# Altium schematic sheet Sheet2.SchDoc
size A4
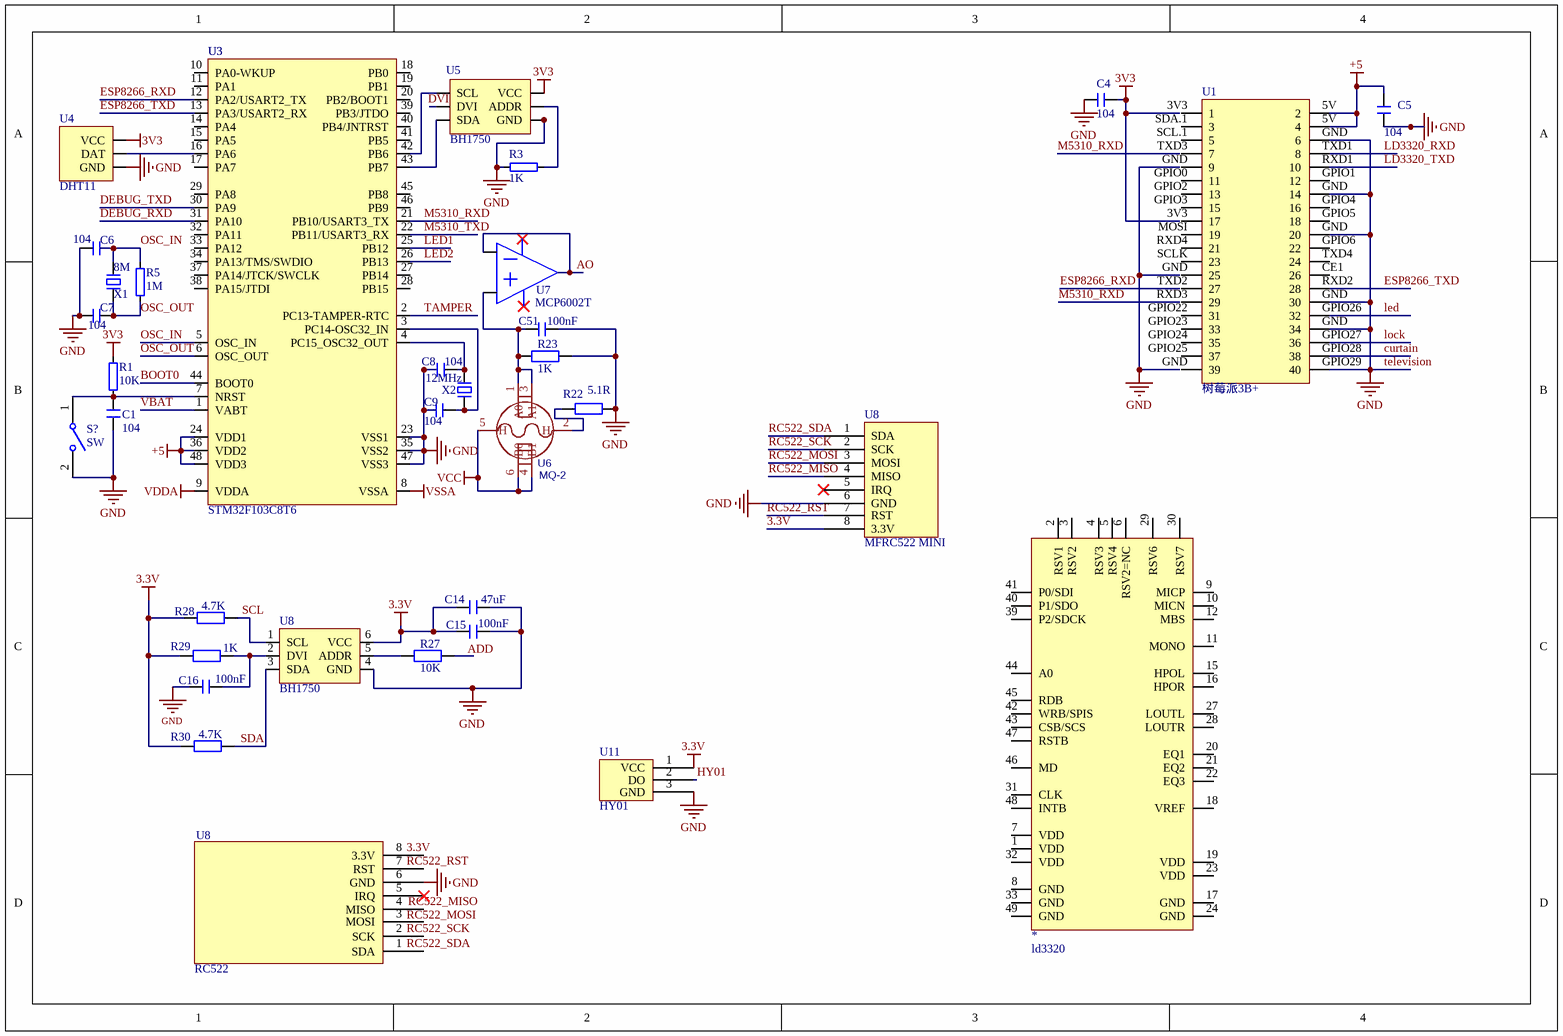
[diagram p0: Sheet2.SchDoc]

## Parts
(Parts that share a designator on the sheet are numbered #1, #2 ... from top to bottom, then left to right.)
*  ld3320
C1  104  [0603C]
C4  104  [0603C]
C5  104  [0603C]
C6  104  [0603C]
C7  104  [0603C]
C8  104  [0603C]
C9  104  [0603C]
C14  47uF  [0603C]
C15  100nF  [C 0805_L]
C16  100nF  [C 0805_L]
C51  100nF  [C 0805_L]
R1  10K  [R 0603_M]
R3  1K  [R 0603_M]
R5  1M  [R 0603_M]
R22  5.1R  [R 0805_L]
R23  1K  [R 0805_L]
R27  10K  [R 0805_L]
R28  4.7K  [R 0805_L]
R29  1K  [R 0805_L]
R30  4.7K  [R 0805_L]
S?  SW  [TSW SMD-3*6*5]
U1  树莓派3B+
U3  STM32F103C8T6  [LQFP-48_M]
U4  DHT11
U5  BH1750
U6  MQ-2  [SENSOR-TH_MQ-2]
U7  MCP6002T  [R 0603_M]
U8#1  MFRC522 MINI
U8#2  BH1750
U8#3  RC522  (part B of 2)
U11  HY01
X1  8M  [OSC UM-5 - duplicate]
X2  12MHz  [OSC UM-5 - duplicate]

## Nets
3.3V: C14.1 C15.2 R28.2 R29.2 R30.2 U8#1.8(3.3V) U8#2.6(VCC) U11.1(VCC)
3V3: C4.1 R1.2 U4.VCC U5.SDA.28(VCC)
+5: C5.1 U1.5V(2) U3.24(VDD1) U3.36(VDD2) U3.48(VDD3)
television: C1.1 C4.2 C5.2 C6.1 C7.1 C8.1 C9.1 C14.2 C15.1 C16.2 C51.1 R3.2 R22.1 R23.1 S?.2 U1.GND(6) U1.GPIO29(40) U3.23(VSS1) U3.35(VSS2) U3.47(VSS3) U4.SDA.23(GND) U5.SDA.30(GND) U8#1.6(GND) U8#2.4(GND) U8#3.6(GND) U11.3(GND)  [also labelled GND]
VCC: U6.4(B1) U6.5(H) U6.6(B0)
VDDA: U3.9(VDDA)
VSSA: U3.8(VSSA)
BOOT0: U3.44(BOOT0)
curtain: U1.GPIO28(38)
DEBUG_RXD: U3.31(PA10)
DEBUG_TXD: U3.30(PA9)
ESP8266_RXD: U3.12(PA2/USART2_TX)
ESP8266_TXD: U1.RXD2(28) U3.13(PA3/USART2_RX)
HY01: U11.2(DO)
LD3320_RXD: U1.TXD1(8)
LD3320_TXD: U1.RXD1(10)
led: U1.GPIO26(32)
LED1: U3.25(PB12)
LED2: U3.26(PB13)
lock: U1.GPIO27(36)
M5310_RXD: U3.21(PB10/USART3_TX)
M5310_TXD: U3.22(PB11/USART3_RX)
OSC_IN: C6.2 R5.2 U3.5(OSC_IN) X1.2
OSC_OUT: C7.2 R5.1 U3.6(OSC_OUT) X1.1
RC522_MISO: U8#1.4(MISO)
RC522_MOSI: U8#1.3(MOSI)
RC522_RST: U8#1.7(RST)
RC522_SCK: U8#1.2(SCK)
RC522_SDA: U8#1.1(SDA)
SCL: R28.1 U8#2.1(SCL)
SDA: R30.1 U8#2.3(SDA)
TAMPER: U3.2(PC13-TAMPER-RTC)
VBAT: U3.1(VABT)
NetC1_2: C1.2 R1.1 S?.1 U3.7(NRST)
NetC8_2: C8.2 U3.4(PC15_OSC32_OUT) X2.1
NetC9_2: C9.2 U3.3(PC14-OSC32_IN) X2.2
NetC16_1: C16.1 R29.1 U8#2.2(DVI)
NetC51_2: C51.2 R23.2 U6.1(A0) U6.3(A1)
NetR3_1: R3.1 U5.SDA.29(ADDR)
NetR22_2: R22.2 U6.2(H)
NetR27_2: R27.2 U8#2.5(ADDR)
NetU3_16: U3.16(PA6) U4.SDA.24(DAT)
NetU3_42: U3.42(PB6) U5.SCL
NetU3_43: U3.43(PB7) U5.SDA.27(SDA)

Not connected (* = marked no-connect by the designer): * 1(VDD) 2(RSV1) 3(RSV2) 4(RSV3) 5(RSV4) 6(RSV2=NC) 7(VDD) 8(GND) 9(MICP) 10(MICN) 11(MONO) 12(MBS) 15(HPOL) 16(HPOR) 17(GND) 18(VREF) 19(VDD) 20(EQ1) 21(EQ2) 22(EQ3) 23(VDD) 24(GND) 27(LOUTL) 28(LOUTR) 29(RSV6) 30(RSV7) 31(CLK) 32(VDD) 33(GND) 39(P2/SDCK) 40(P1/SDO) 41(P0/SDI) 42(WRB/SPIS) 43(CSB/SCS) 44(A0) 45(RDB) 46(MD) 47(RSTB) 48(INTB) 49(GND); R27 1; U1 3V3(1) CE1(26) GPIO0(11) GPIO1(12) GPIO2(13) GPIO3(15) GPIO4(16) GPIO5(18) GPIO6(22) GPIO22(31) GPIO23(33) GPIO24(35) GPIO25(37) MOSI(19) RXD3(29) RXD4(21) SCL.1(5) SCLK(23) SDA.1(3) TXD2(27) TXD3(7) TXD4(24); U3 10(PA0-WKUP) 11(PA1) 14(PA4) 15(PA5) 17(PA7) 18(PB0) 19(PB1) 20(PB2/BOOT1) 27(PB14) 28(PB15) 29(PA8) 32(PA11) 33(PA12) 34(PA13/TMS/SWDIO) 37(PA14/JTCK/SWCLK) 38(PA15/JTDI) 39(PB3/JTDO) 40(PB4/JNTRST) 41(PB5) 45(PB8) 46(PB9); U5 SDA.26(DVI); U8#1 5(IRQ)*; U8#3 1(SDA) 2(SCK) 3(MOSI) 4(MISO) 5(IRQ)* 7(RST) 8(3.3V)

## Notes on the sheet
- (near U3) U3
- (near U1) 树莓派3B+
- U8
- Labels drawn without touching a wire or pin: 3.3V, ADD, DVI, RC522_MISO, RC522_MOSI, RC522_RST, RC522_SCK, RC522_SDA

## Library data of the parts
C1 C4-C9 C14-C16 C51 = C: 无极性贴片电容; 版权归属: 源创客; BOM名称: 无极性贴片电容; 学习资源: www.ooocke.com
R1 R3 R5 U7 = 普通电阻
R22 R23 R27-R30 = R: 贴片电阻; 版权归属: 源创客; BOM名称: 贴片电阻; 学习资源: www.ooocke.com
S? = KCD1-101: 1路单刀船型开关; 版权归属: 源创客; BOM名称: 1路单刀船型开关; 学习资源: www.ooocke.com
U1 = pi
U3 = STM32F103C8T6: IC
U6 = MQ-2: BOM_Manufacturer: Winsen; BOM_Paste Type: expand; BOM_Supplier: LCSC; BOM_Manufacturer Part: MQ-2; BOM_Supplier Part: C99296; spicePre: U; spiceSymbolName: MQ-2
U8#1 = RC522
X1 X2 = XTAL-2P: 2脚无源脚晶振; 版权归属: 源创客; BOM名称: 2脚无源脚晶振; 学习资源: www.ooocke.com